# Altium schematic sheet TEMP_IMU_NAND.SchDoc: Mach Probe Data Logger
size A4; Author: Bexultan Tokkozha; CompanyName: WARR; DrawnBy: Bexultan Tokkozha; Organization: WARR e.V.; Address1: Boltzmannstr. 15; Address2: 85748 Garching; Address3: Germany; Revision: Rev.3; SheetNumber: 2; SheetTotal: 2; ReviewDate: 05.04.2025
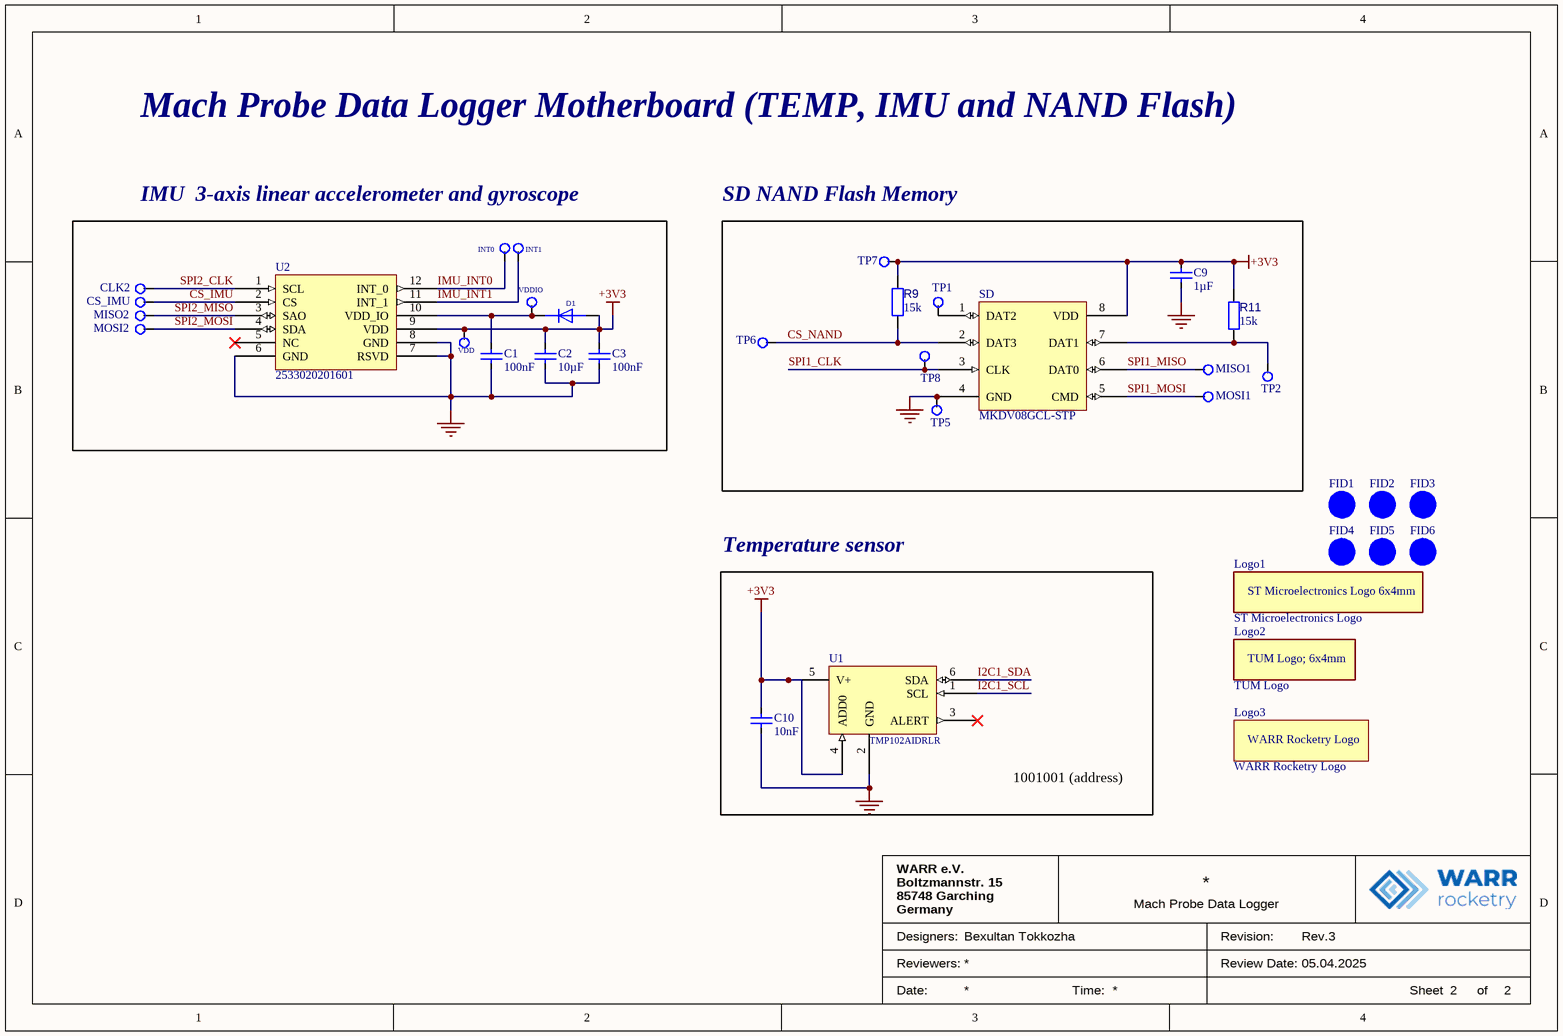
[diagram p0: TEMP_IMU_NAND.SchDoc]

## Parts
C1  value 100nF  [CAP_0603]  (hidden comment: C_0603_100n_5%_50V)
C2  value 10µF  [GCM188R71E224KA55J]  (hidden comment: C_0603_10uF)
C3  value 100nF  [CAP_0603]  (hidden comment: C_0603_100n_5%_50V)
C9  value 1µF  [CAP_0603]  (hidden comment: C_0603_1u_10%_50V)
C10  value 10nF  [CAP_0603]  (hidden comment: C_0603_10n_5%_50V)
CLK2  Testpoint  [Testpoint-Footprint-1]  (value not drawn)  (no BOM)
CS_IMU  Testpoint  [Testpoint-Footprint-1]  (value not drawn)  (no BOM)
D1  BAT60A  [BAT60A]  (value not drawn)
FID1  Fiducial  [Fiducial_1mm]  (value not drawn)  (no BOM)
FID2  Fiducial  [Fiducial_1mm]  (value not drawn)  (no BOM)
FID3  Fiducial  [Fiducial_1mm]  (value not drawn)  (no BOM)
FID4  Fiducial  [Fiducial_1mm]  (value not drawn)  (no BOM)
FID5  Fiducial  [Fiducial_1mm]  (value not drawn)  (no BOM)
FID6  Fiducial  [Fiducial_1mm]  (value not drawn)  (no BOM)
INT0  Testpoint  [Testpoint-Footprint-1]  (value not drawn)  (no BOM)
INT1  Testpoint  [Testpoint-Footprint-1]  (value not drawn)  (no BOM)
Logo1  ST Microelectronics Logo  [New footprint 1]
Logo2  TUM Logo  [New footprint 1]
Logo3  WARR Rocketry Logo  [WARR Rocketry Logo-Footprint-1]
MISO1  Testpoint  [Testpoint-Footprint-1]  (value not drawn)  (no BOM)
MISO2  Testpoint  [Testpoint-Footprint-1]  (value not drawn)  (no BOM)
MOSI1  Testpoint  [Testpoint-Footprint-1]  (value not drawn)  (no BOM)
MOSI2  Testpoint  [Testpoint-Footprint-1]  (value not drawn)  (no BOM)
R9  value 15k  [R_0603_Yageo]  (hidden comment: RES_0603_15k)
R11  value 15k  [R_0603_Yageo]  (hidden comment: RES_0603_15k)
SD  MKDV08GCL-STP  [New footprint 1]
TP1  Testpoint  [Testpoint-Footprint-1]  (value not drawn)  (no BOM)
TP2  Testpoint  [Testpoint-Footprint-1]  (value not drawn)  (no BOM)
TP5  Testpoint  [Testpoint-Footprint-1]  (value not drawn)  (no BOM)
TP6  Testpoint  [Testpoint-Footprint-1]  (value not drawn)  (no BOM)
TP7  Testpoint  [Testpoint-Footprint-1]  (value not drawn)  (no BOM)
TP8  Testpoint  [Testpoint-Footprint-1]  (value not drawn)  (no BOM)
U1  TMP102AIDRLR  [SOTFL127P600-8N]
U2  2533020201601  [QFN50P200X200X70-12N]
VDD  Testpoint  [Testpoint-Footprint-1]  (value not drawn)  (no BOM)
VDDIO  Testpoint  [Testpoint-Footprint-1]  (value not drawn)  (no BOM)

## Blocks framed on the sheet
IMU  3-axis linear accelerometer and gyroscope: C1-C3 CLK2 CS_IMU D1 INT0 INT1 MISO2 MOSI2 U2 VDD VDDIO
SD NAND Flash Memory: C9 MISO1 MOSI1 R9 R11 SD TP1 TP2 TP5-TP8
Temperature sensor: C10 U1

## Nets
+3V3: C2.1 C3.1 C9.1 C10.1 D1.1(A) R9.2 R11.2 SD.8(VDD) TP7.1 U1.4(ADD0) U1.5(V+) U2.9(VDD) VDD.1
GND: C1.1 C2.2 C3.2 C9.2 C10.2 SD.4(GND) TP5.1 U1.2(GND) U2.6(GND) U2.7(RSVD) U2.8(GND)
CS_IMU: CS_IMU.1 U2.2(CS)
CS_NAND: R9.1 SD.2(DAT3) TP6.1
I2C1_SCL: U1.1(SCL)
I2C1_SDA: U1.6(SDA)
IMU_INT0: INT0.1 U2.12(INT_0)
IMU_INT1: INT1.1 U2.11(INT_1)
SPI1_CLK: SD.3(CLK) TP8.1
SPI1_MISO: MISO1.1 SD.6(DAT0)
SPI1_MOSI: MOSI1.1 SD.5(CMD)
SPI2_CLK: CLK2.1 U2.1(SCL)
SPI2_MISO: MISO2.1 U2.3(SAO)
SPI2_MOSI: MOSI2.1 U2.4(SDA)
NetC1_2: C1.2 D1.2(K) U2.10(VDD_IO) VDDIO.1
NetR11_1: R11.1 SD.7(DAT1) TP2.1
NetSD_1: SD.1(DAT2) TP1.1

Not connected (* = marked no-connect by the designer): U1 3(ALERT)*; U2 5(NC)*

## Notes on the sheet
- Mach Probe Data Logger Motherboard (TEMP, IMU and NAND Flash)
- 1001001 (address)
- Designers:
- Reviewers:
- Date:
- Time:
- Revision:
- Review Date:
- Sheet
- of
- (in symbol CMP-00030-00022-1) TUM Logo; 6x4mm

## Library data of the parts
C1 C3 = CMP-001-00115-4: Ceramic Capacitor, Multilayer, Ceramic, 50V, 5% +Tol, 5% -Tol, X7R, 15% TC, 0.1uF, Surface Mount, 0603; Voltage Rating: 50V; Capacitor Type: Ceramic; Max Operating Temperature: 125°C; Pins: 2; Case/Package: 0603; Min Operating Temperature: -55°C; Mounting Technology: Surface Mount; RoHS Compliant: Yes
C2 = CMP-001-00105-2: Ceramic Capacitor, Multilayer, Ceramic, 16V, 20% +Tol, 20% -Tol, X6S, 22% TC, 10uF, Surface Mount, 0603; Multilayer: Yes; Max Operating Temperature: 105°C; Package Shape: Rectangular; Capacitor Type: Ceramic; Case/Package: 0603; Temperature Characteristics Code: X6S; Height: 0.8mm; Length: 1.6mm; Packaging: Tape and Reel; Terminal Finish: Nickel; JESD-609 Code: e3; Dielectric Material: Ceramic; Pins: 2; Tolerance  (fill in as +-): 20%; RoHS Compliant: Yes; Mounting Technology: Surface Mount; Termination: Wraparound; Min Operating Temperature: -55°C; Width: 0.8mm; Reach SVHC Compliant: Yes; Package Style: SMTMeter; Tolerance (fill in as +-): 20%; Rated DC Voltage (URdc): 16V
C9 = CMP-001-00112-5: Ceramic Capacitor, Multilayer, Ceramic, 50V, 10% +Tol, 10% -Tol, 1uF, Surface Mount, 0603; Min Operating Temperature: -55°C; Pins: 2; Mounting Technology: Surface Mount; Voltage Rating: 50V; RoHS Compliant: Yes; Case/Package: 0603; Max Operating Temperature: 85°C; Capacitor Type: Ceramic
C10 = CMP-001-00107-9: Ceramic Capacitor, Multilayer, Ceramic, 50V, 5% +Tol, 5% -Tol, X7R, 15% TC, 0.01uF, Surface Mount, 0603; Capacitor Type: Ceramic; Mounting Technology: Surface Mount; Tolerance: 5%; Case/Package: 0603; Pins: 2; Voltage Rating: 50V; RoHS Compliant: Yes; Min Operating Temperature: -55°C; Max Operating Temperature: 125°C
CLK2 CS_IMU INT0 INT1 MISO1 MISO2 MOSI1 MOSI2 TP1 TP2 TP5-TP8 VDD VDDIO = CMP-00030-00002-7: Schematic for Testpoint
D1 = CMP-004-00038-1: Rectifier Diode, Shottky, 3A, 10V; Max Surge Current: 5A; Max Operating Temperature: 150°C; RoHS Compliant: Yes; Forward Current: 3A; Min Operating Temperature: -55°C; Mounting Technology: SMT; Peak Inverse Voltage: 10V
FID1-FID6 = CMP-00055-6: 1mm Fiducial
Logo1 = CMP-00030-00023-1: ST Microelectronics Logo 6x4mm
Logo2 = CMP-00030-00022-1: 6 x 4 mm TUM Logo
Logo3 = CMP-00030-00024-1
R9 R11 = CMP-009-00285-1: Fixed Resistor, Metal Glaze/thick Film, 0.1W, 15000ohm, 75V, 1% +/-Tol, 100ppm/Cel, Surface Mount, 0603; Power: 100mW; Tolerance: 1%; Mounting Technology: SMD; Voltage Rating: 75V; LCSC Part Number (0 if N/A): 0; Case/Package: 0603; Mouser Part Number (0 if N/A): 0
SD = CMP-016-000053-1: LCSC Part Number (0 if N/A): C19192126; Mouser Part Number (0 if N/A): 0
U1 = CMP-00053-2: Digital Temperature Sensor, I2C,12 Bit(s), ±2C, SOT563; Min Operating Temperature: -40°C; Max Operating Temperature: 125°C; LCSC Part Number: C99269; Mouser Part Number: 595-TMP102AIDRLR
U2 = CMP-00083-2: WSEN-ITDS Accelerometer X, Y, Z Axis ±2g, 4g, 8g, 16g 0.08Hz ~ 400Hz 12-LGA (2x2); Mouser Part Number (0 if N/A): 710-2533020201601; LCSC Part Number (0 if N/A): 0